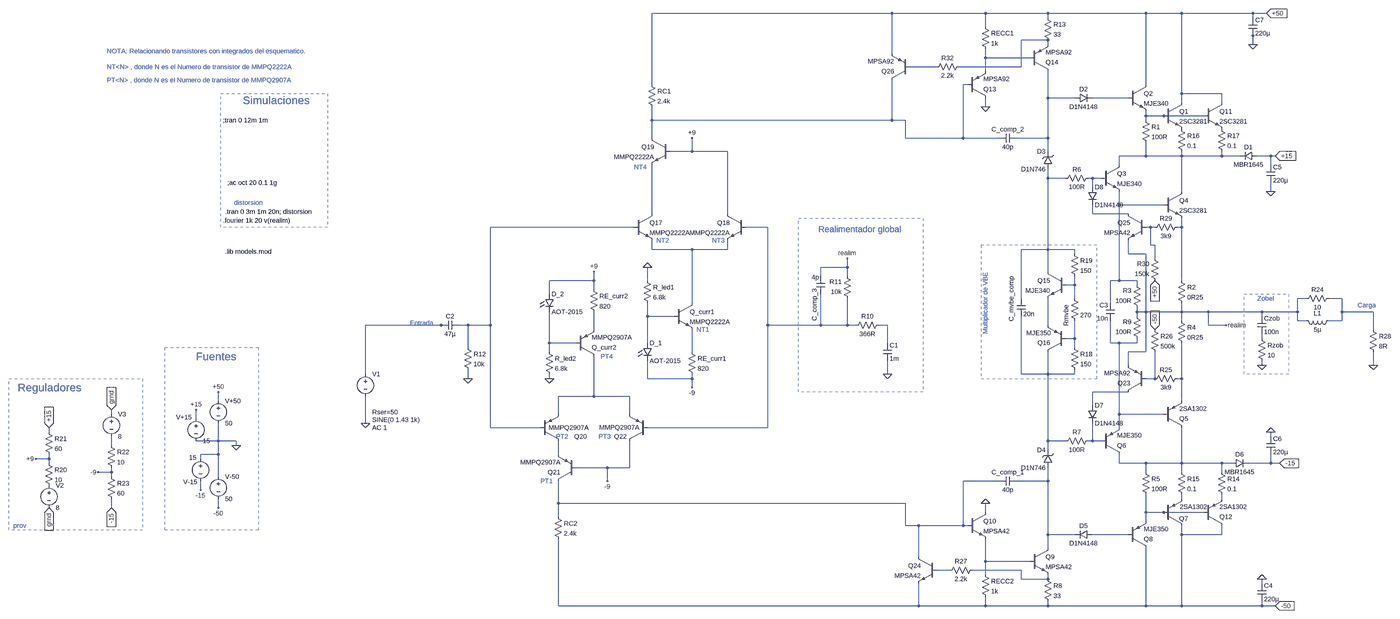
[diagram p0: schematic protecciones10-jun.asc, whole sheet]
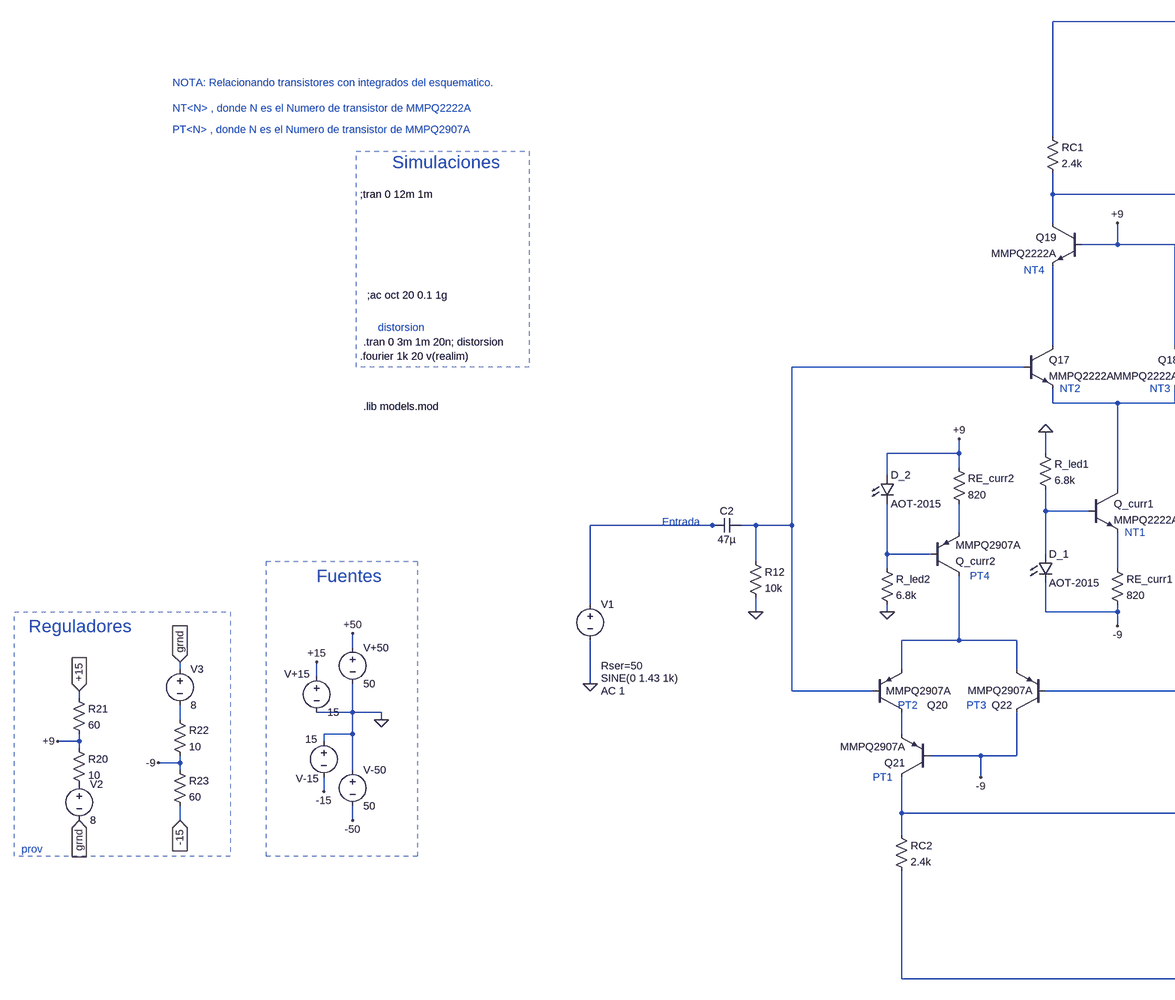
[diagram p1: schematic protecciones10-jun.asc, part, row 1 of 1, column 1 of 2]
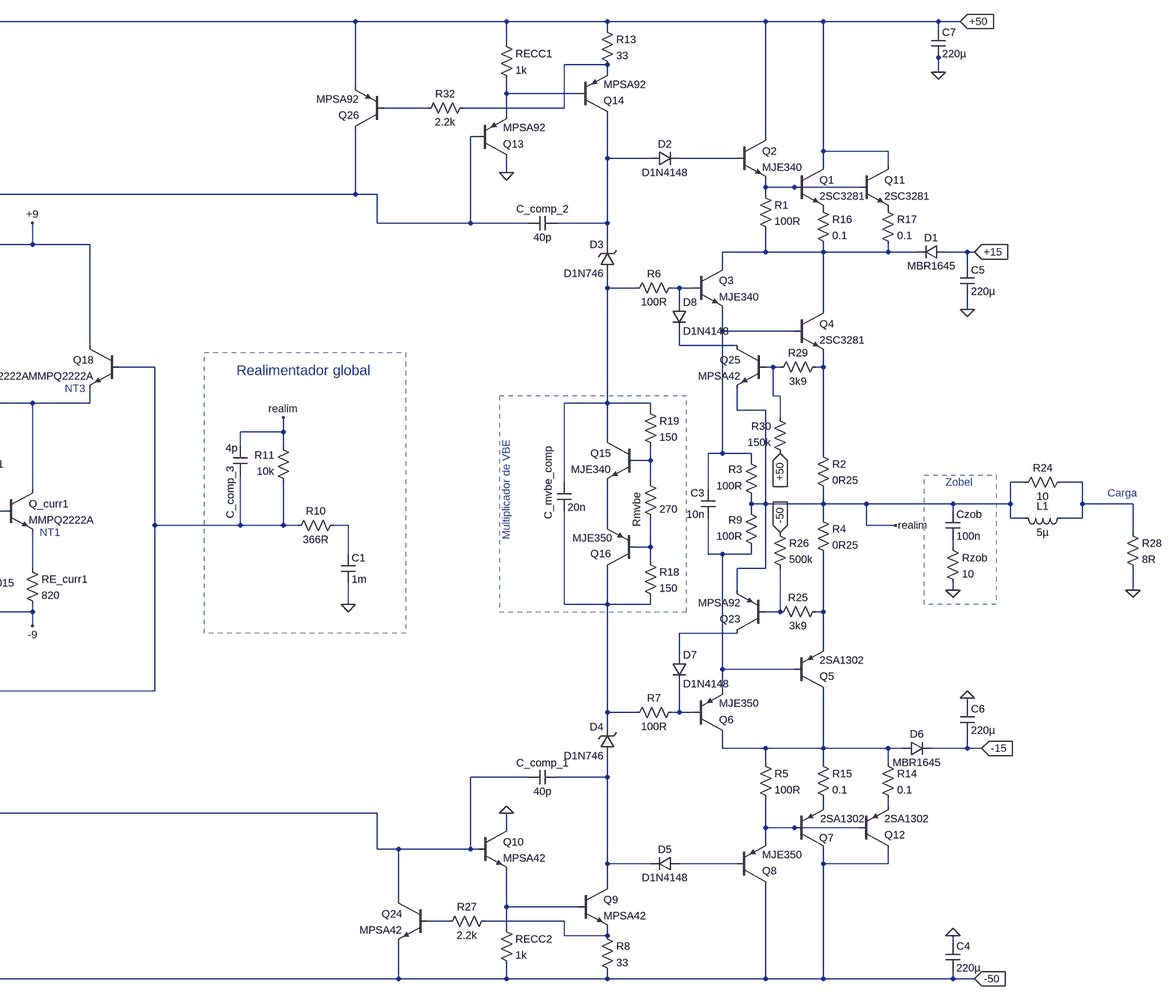
[diagram p2: schematic protecciones10-jun.asc, part, row 1 of 1, column 2 of 2]
protecciones10-jun.asc, the LTspice schematic file:
Version 4
SHEET 1 6132 1256
WIRE 1344 -944 464 -944
WIRE 1680 -944 1344 -944
WIRE 1904 -944 1680 -944
WIRE 2256 -944 1904 -944
WIRE 2384 -944 2256 -944
WIRE 2640 -944 2384 -944
WIRE 2688 -944 2640 -944
WIRE 1904 -928 1904 -944
WIRE 2640 -928 2640 -944
WIRE 1680 -896 1680 -944
WIRE 2640 -864 2640 -880
WIRE 1904 -848 1808 -848
WIRE 1904 -832 1904 -848
WIRE 2640 -832 2640 -864
WIRE 1344 -800 1344 -944
WIRE 1680 -784 1680 -816
WIRE 1840 -784 1680 -784
WIRE 1504 -752 1408 -752
WIRE 1808 -752 1808 -848
WIRE 1808 -752 1584 -752
WIRE 1680 -736 1680 -784
WIRE 464 -688 464 -944
WIRE 1616 -688 1600 -688
WIRE 2256 -688 2256 -944
WIRE 2384 -656 2384 -944
WIRE 2528 -656 2384 -656
WIRE 1904 -640 1904 -736
WIRE 2000 -640 1904 -640
WIRE 2192 -640 2064 -640
WIRE 2384 -624 2384 -656
WIRE 2528 -624 2528 -656
WIRE 1680 -608 1680 -640
WIRE 2256 -576 2256 -592
WIRE 2320 -576 2256 -576
WIRE 2464 -576 2320 -576
WIRE 464 -560 464 -608
WIRE 1344 -560 1344 -704
WIRE 1344 -560 464 -560
WIRE 1392 -560 1344 -560
WIRE 2256 -560 2256 -576
WIRE 464 -496 464 -560
WIRE 1392 -496 1392 -560
WIRE 1600 -496 1600 -688
WIRE 1600 -496 1392 -496
WIRE 1728 -496 1600 -496
WIRE 1904 -496 1904 -640
WIRE 1904 -496 1792 -496
WIRE 608 -448 608 -496
WIRE 608 -448 528 -448
WIRE 736 -448 608 -448
WIRE 1904 -448 1904 -496
WIRE 2256 -432 2256 -480
WIRE 2256 -432 2160 -432
WIRE 2384 -432 2384 -448
WIRE 2384 -432 2256 -432
WIRE 2528 -432 2528 -448
WIRE 2528 -432 2384 -432
WIRE 2592 -432 2528 -432
WIRE 2704 -432 2656 -432
WIRE 2720 -432 2704 -432
WIRE 2160 -400 2160 -432
WIRE 2704 -400 2704 -432
WIRE 1904 -352 1904 -384
WIRE 1968 -352 1904 -352
WIRE 2064 -352 2048 -352
WIRE 2096 -352 2064 -352
WIRE 2064 -320 2064 -352
WIRE 2384 -304 2384 -432
WIRE 2704 -304 2704 -336
WIRE 2160 -256 2160 -304
WIRE 2320 -256 2160 -256
WIRE 464 -224 464 -400
WIRE 736 -224 736 -448
WIRE 2064 -224 2064 -256
WIRE 2192 -224 2064 -224
WIRE 400 -176 -128 -176
WIRE 880 -176 800 -176
WIRE 2272 -176 2256 -176
WIRE 2288 -176 2272 -176
WIRE 2384 -176 2384 -208
WIRE 2384 -176 2368 -176
WIRE 2272 -112 2272 -176
WIRE 2288 -112 2272 -112
WIRE 464 -96 464 -128
WIRE 608 -96 464 -96
WIRE 736 -96 736 -128
WIRE 736 -96 608 -96
WIRE 1904 -96 1904 -352
WIRE 1904 -96 1808 -96
WIRE 2000 -96 1904 -96
WIRE 2000 -80 2000 -96
WIRE 2192 -80 2192 -128
WIRE 2256 -80 2192 -80
WIRE 2288 -64 2288 -112
WIRE 1184 -32 1184 -64
WIRE 1184 -32 1088 -32
WIRE 1904 -16 1904 -96
WIRE 1088 0 1088 -32
WIRE 1184 0 1184 -32
WIRE 256 16 256 -16
WIRE 256 16 96 16
WIRE 448 16 448 -32
WIRE 2160 16 2160 -256
WIRE 2160 16 2128 16
WIRE 2224 16 2160 16
WIRE 2384 16 2384 -176
WIRE 2000 32 2000 0
WIRE 2000 32 1968 32
WIRE 2224 32 2224 16
WIRE 256 48 256 16
WIRE 96 64 96 16
WIRE 1808 80 1808 -96
WIRE 2000 80 2000 32
WIRE 2832 80 2800 80
WIRE 2960 80 2912 80
WIRE 608 96 608 -96
WIRE 2128 96 2128 16
WIRE 2224 128 2224 112
WIRE 2256 128 2256 -80
WIRE 2256 128 2224 128
WIRE 2384 128 2384 96
WIRE 2384 128 2256 128
WIRE 2480 128 2384 128
WIRE 2672 128 2480 128
WIRE 2800 128 2800 80
WIRE 2800 128 2672 128
WIRE 2960 128 2960 80
WIRE 3072 128 2960 128
WIRE 448 144 448 96
WIRE 544 144 448 144
WIRE 2224 144 2224 128
WIRE 2672 144 2672 128
WIRE 2384 160 2384 128
WIRE 2800 160 2800 128
WIRE 2832 160 2800 160
WIRE 2960 160 2960 128
WIRE 2960 160 2912 160
WIRE -304 176 -576 176
WIRE -288 176 -304 176
WIRE -208 176 -240 176
WIRE -128 176 -128 -176
WIRE -128 176 -208 176
WIRE 880 176 880 -176
WIRE 1088 176 1088 64
WIRE 1088 176 880 176
WIRE 1184 176 1184 80
WIRE 1184 176 1088 176
WIRE 1216 176 1184 176
WIRE 1328 176 1296 176
WIRE 1904 176 1904 80
WIRE 2480 176 2480 128
WIRE 2544 176 2480 176
WIRE 256 192 256 128
WIRE 3072 192 3072 128
WIRE 2000 224 2000 160
WIRE 2000 224 1968 224
WIRE 2672 224 2672 208
WIRE 96 240 96 128
WIRE 192 240 96 240
WIRE 448 240 448 144
WIRE 1328 240 1328 176
WIRE 2128 240 2128 160
WIRE 2160 240 2128 240
WIRE 2224 240 2224 224
WIRE 2224 240 2160 240
WIRE -208 256 -208 176
WIRE 2000 256 2000 224
WIRE 96 272 96 240
WIRE 608 272 608 192
WIRE 2256 272 2256 128
WIRE 2256 272 2192 272
WIRE 2192 320 2192 272
WIRE 2672 320 2672 304
WIRE 3072 320 3072 272
WIRE -576 352 -576 176
WIRE 1328 352 1328 304
WIRE 1808 352 1808 144
WIRE 1904 352 1904 272
WIRE 1904 352 1808 352
WIRE 2000 352 2000 336
WIRE 2000 352 1904 352
WIRE -208 368 -208 336
WIRE 96 368 96 352
WIRE 448 368 448 304
WIRE 608 368 608 352
WIRE 608 368 448 368
WIRE 2288 368 2288 272
WIRE 2288 368 2256 368
WIRE 2384 368 2384 240
WIRE 2384 368 2368 368
WIRE 608 400 608 368
WIRE 2192 416 2064 416
WIRE 256 432 256 288
WIRE 256 432 128 432
WIRE 384 432 256 432
WIRE -1184 448 -1184 416
WIRE 2384 448 2384 368
WIRE 2064 464 2064 416
WIRE -1568 496 -1568 480
WIRE 128 496 128 432
WIRE 384 496 384 432
WIRE 2160 496 2160 240
WIRE 2320 496 2160 496
WIRE -1264 512 -1264 480
WIRE -576 528 -576 432
WIRE -128 544 -128 176
WIRE 64 544 -128 544
WIRE 880 544 880 176
WIRE 880 544 448 544
WIRE 2160 544 2160 496
WIRE -1792 560 -1792 544
WIRE 2704 576 2704 560
WIRE -1184 592 -1184 528
WIRE -1184 592 -1264 592
WIRE -1120 592 -1184 592
WIRE 1904 592 1904 352
WIRE 1968 592 1904 592
WIRE 2064 592 2064 528
WIRE 2064 592 2048 592
WIRE 2096 592 2064 592
WIRE -1568 608 -1568 576
WIRE -1120 608 -1120 592
WIRE 1904 624 1904 592
WIRE -1184 640 -1184 592
WIRE -1184 640 -1248 640
WIRE 128 640 128 592
WIRE -1792 656 -1792 640
WIRE -1792 656 -1840 656
WIRE -1248 656 -1248 640
WIRE -1792 672 -1792 656
WIRE 2160 672 2160 640
WIRE 2256 672 2160 672
WIRE 2304 672 2256 672
WIRE 2384 672 2384 544
WIRE 2384 672 2304 672
WIRE 2528 672 2384 672
WIRE 2560 672 2528 672
WIRE 2704 672 2704 640
WIRE 2704 672 2624 672
WIRE 2736 672 2704 672
WIRE 304 688 192 688
WIRE 384 688 384 592
WIRE 384 688 304 688
WIRE -1568 704 -1568 688
WIRE -1568 704 -1616 704
WIRE 2256 704 2256 672
WIRE 2384 704 2384 672
WIRE 2528 704 2528 672
WIRE -1568 720 -1568 704
WIRE -1184 720 -1184 640
WIRE 304 736 304 688
WIRE 1728 736 1600 736
WIRE 1904 736 1904 688
WIRE 1904 736 1792 736
WIRE -1248 768 -1248 736
WIRE 2384 800 2384 784
WIRE 2528 800 2528 784
WIRE 128 816 128 736
WIRE 1392 816 128 816
WIRE -1568 832 -1568 800
WIRE -1184 832 -1184 800
WIRE 1680 848 1680 816
WIRE 2256 848 2256 784
WIRE 2320 848 2256 848
WIRE 2464 848 2320 848
WIRE 128 864 128 816
WIRE 2256 880 2256 848
WIRE 1392 896 1392 816
WIRE 1440 896 1392 896
WIRE 1600 896 1600 736
WIRE 1600 896 1440 896
WIRE 1616 896 1600 896
WIRE 1904 928 1904 736
WIRE 2000 928 1904 928
WIRE 2192 928 2064 928
WIRE 2384 928 2384 896
WIRE 2528 928 2528 896
WIRE 2528 928 2384 928
WIRE 1904 976 1904 928
WIRE 1440 1008 1440 896
WIRE 1680 1024 1680 944
WIRE 1840 1024 1680 1024
WIRE 1552 1056 1504 1056
WIRE 1808 1056 1632 1056
WIRE 1680 1072 1680 1024
WIRE 1808 1088 1808 1056
WIRE 1904 1088 1904 1072
WIRE 1904 1088 1808 1088
WIRE 2672 1104 2672 1088
WIRE 128 1184 128 944
WIRE 1440 1184 1440 1104
WIRE 1440 1184 128 1184
WIRE 1680 1184 1680 1152
WIRE 1680 1184 1440 1184
WIRE 1904 1184 1904 1168
WIRE 1904 1184 1680 1184
WIRE 2256 1184 2256 976
WIRE 2256 1184 1904 1184
WIRE 2384 1184 2384 928
WIRE 2384 1184 2256 1184
WIRE 2672 1184 2672 1168
WIRE 2672 1184 2384 1184
WIRE 2720 1184 2672 1184
FLAG -1120 608 0
FLAG -1184 416 +50
FLAG -1264 480 +15
FLAG -1248 768 -15
FLAG -1184 832 -50
FLAG 2720 1184 -50
IOPIN 2720 1184 In
FLAG 2736 672 -15
IOPIN 2736 672 In
FLAG 2688 -944 +50
IOPIN 2688 -944 In
FLAG 2720 -432 +15
IOPIN 2720 -432 In
FLAG 1184 -64 realim
FLAG 2544 176 realim
FLAG -208 368 0
FLAG 1680 -608 0
FLAG 1680 816 0
FLAG 2640 -832 0
FLAG 2704 -304 0
FLAG 2704 560 0
FLAG 2672 1088 0
FLAG -1792 544 +15
IOPIN -1792 544 In
FLAG -1792 832 grnd
IOPIN -1792 832 In
FLAG -1840 656 +9
FLAG -1568 480 grnd
IOPIN -1568 480 In
FLAG -1616 704 -9
FLAG -1568 832 -15
IOPIN -1568 832 In
FLAG 608 -496 +9
FLAG 608 400 -9
FLAG 256 -16 +9
FLAG 304 736 -9
FLAG 96 368 0
FLAG 448 -32 0
FLAG 1328 352 0
FLAG 2672 320 0
FLAG -576 528 0
FLAG 3072 320 0
FLAG 2288 16 +50
IOPIN 2288 16 In
FLAG 2288 192 -50
IOPIN 2288 192 In
DATAFLAG 2304 672 "round($*100)/100"
DATAFLAG -1792 656 "round($*100)/100"
DATAFLAG -1568 704 "round($*100)/100"
SYMBOL voltage -1248 640 R0
WINDOW 0 -62 99 Left 2
WINDOW 3 -41 12 Left 2
WINDOW 123 0 0 Left 2
WINDOW 39 0 0 Left 2
SYMATTR InstName V-15
SYMATTR Value 15
SYMBOL voltage -1184 432 R0
SYMATTR InstName V+50
SYMATTR Value 50
SYMBOL voltage -1264 496 R0
WINDOW 0 -72 11 Left 2
SYMATTR InstName V+15
SYMATTR Value 15
SYMBOL voltage -1184 704 R0
SYMATTR InstName V-50
SYMATTR Value 50
SYMBOL npn 2320 -624 R0
SYMATTR InstName Q1
SYMATTR Value 2SC3281
SYMBOL npn 2192 -688 R0
SYMATTR InstName Q2
SYMATTR Value MJE340
SYMBOL res 2240 -576 R0
SYMATTR InstName R1
SYMATTR Value 100R
SYMBOL diode 2656 -416 M270
WINDOW 0 32 32 VTop 2
WINDOW 3 0 32 VBottom 2
SYMATTR InstName D1
SYMATTR Value MBR1645
SYMBOL diode 2000 -624 R270
WINDOW 0 32 32 VTop 2
WINDOW 3 0 32 VBottom 2
SYMATTR InstName D2
SYMATTR Value D1N4148
SYMBOL zener 1920 -384 R180
WINDOW 0 24 64 Left 2
WINDOW 3 24 0 Left 2
SYMATTR InstName D3
SYMATTR Value D1N746
SYMBOL npn 2096 -400 R0
SYMATTR InstName Q3
SYMATTR Value MJE340
SYMBOL npn 2320 -304 R0
SYMATTR InstName Q4
SYMATTR Value 2SC3281
SYMBOL res 2368 0 R0
SYMATTR InstName R2
SYMATTR Value 0R25
SYMBOL res 2240 128 R180
WINDOW 0 36 76 Left 2
WINDOW 3 36 40 Left 2
SYMATTR InstName R3
SYMATTR Value 100R
SYMBOL res 2368 144 R0
SYMATTR InstName R4
SYMATTR Value 0R25
SYMBOL pnp 2320 544 M180
SYMATTR InstName Q5
SYMATTR Value 2SA1302
SYMBOL pnp 2096 640 M180
SYMATTR InstName Q6
SYMATTR Value MJE350
SYMBOL pnp 2320 896 M180
WINDOW 0 55 25 Left 2
WINDOW 3 57 68 Left 2
SYMATTR InstName Q7
SYMATTR Value 2SA1302
SYMBOL pnp 2192 976 M180
SYMATTR InstName Q8
SYMATTR Value MJE350
SYMBOL res 2240 688 R0
SYMATTR InstName R5
SYMATTR Value 100R
SYMBOL zener 1920 688 R180
WINDOW 0 24 64 Left 2
WINDOW 3 24 0 Left 2
SYMATTR InstName D4
SYMATTR Value D1N746
SYMBOL diode 2064 912 R90
WINDOW 0 0 32 VBottom 2
WINDOW 3 32 32 VTop 2
SYMATTR InstName D5
SYMATTR Value D1N4148
SYMBOL diode 2560 688 R270
WINDOW 0 32 32 VTop 2
WINDOW 3 0 32 VBottom 2
SYMATTR InstName D6
SYMATTR Value MBR1645
SYMBOL res 2064 -368 R90
WINDOW 0 0 56 VBottom 2
WINDOW 3 32 56 VTop 2
SYMATTR InstName R6
SYMATTR Value 100R
SYMBOL res 2064 576 R90
WINDOW 0 0 56 VBottom 2
WINDOW 3 32 56 VTop 2
SYMATTR InstName R7
SYMATTR Value 100R
SYMBOL npn 1840 976 R0
SYMATTR InstName Q9
SYMATTR Value MPSA42
SYMBOL res 1888 1072 R0
SYMATTR InstName R8
SYMATTR Value 33
SYMBOL npn 1616 848 R0
SYMATTR InstName Q10
SYMATTR Value MPSA42
SYMBOL res 2240 240 R180
WINDOW 0 36 76 Left 2
WINDOW 3 36 40 Left 2
SYMATTR InstName R9
SYMATTR Value 100R
SYMBOL res 1200 192 R270
WINDOW 0 32 56 VTop 2
WINDOW 3 0 56 VBottom 2
SYMATTR InstName R10
SYMATTR Value 366R
SYMBOL res 1200 96 R180
WINDOW 0 36 76 Left 2
WINDOW 3 36 40 Left 2
SYMATTR InstName R11
SYMATTR Value 10k
SYMBOL res -224 240 R0
SYMATTR InstName R12
SYMATTR Value 10k
SYMBOL cap 1312 240 R0
SYMATTR InstName C1
SYMATTR Value 1m
SYMBOL cap -240 160 R90
WINDOW 0 0 32 VBottom 2
WINDOW 3 32 32 VTop 2
SYMATTR InstName C2
SYMATTR Value 47µ
SYMBOL cap 1792 720 R90
WINDOW 0 0 32 VBottom 2
WINDOW 3 32 32 VTop 2
SYMATTR InstName C_comp_1
SYMATTR Value 40p
SYMBOL cap 2144 160 R180
WINDOW 0 24 56 Left 2
WINDOW 3 24 8 Left 2
SYMATTR InstName C3
SYMATTR Value 10n
SYMBOL npn 2464 -624 R0
SYMATTR InstName Q11
SYMATTR Value 2SC3281
SYMBOL pnp 2464 896 M180
SYMATTR InstName Q12
SYMATTR Value 2SA1302
SYMBOL cap 2656 1104 R0
SYMATTR InstName C4
SYMATTR Value 220µ
SYMBOL cap 2688 -400 R0
SYMATTR InstName C5
SYMATTR Value 220µ
SYMBOL cap 2688 576 R0
SYMATTR InstName C6
SYMATTR Value 220µ
SYMBOL cap 2624 -928 R0
SYMATTR InstName C7
SYMATTR Value 220µ
SYMBOL pnp 1616 -640 M180
SYMATTR InstName Q13
SYMATTR Value MPSA92
SYMBOL pnp 1840 -736 M180
SYMATTR InstName Q14
SYMATTR Value MPSA92
SYMBOL cap 1792 -512 R90
WINDOW 0 0 32 VBottom 2
WINDOW 3 32 32 VTop 2
SYMATTR InstName C_comp_2
SYMATTR Value 40p
SYMBOL res 1888 -944 R0
SYMATTR InstName R13
SYMATTR Value 33
SYMBOL res 2512 688 R0
SYMATTR InstName R14
SYMATTR Value 0.1
SYMBOL res 2368 688 R0
SYMATTR InstName R15
SYMATTR Value 0.1
SYMBOL res 2368 -544 R0
SYMATTR InstName R16
SYMATTR Value 0.1
SYMBOL res 2512 -544 R0
SYMATTR InstName R17
SYMATTR Value 0.1
SYMBOL cap 1104 64 R180
WINDOW 0 38 20 VLeft 2
WINDOW 3 21 60 Left 2
SYMATTR InstName C_comp_3
SYMATTR Value 4p
SYMBOL npn 1968 -16 M0
SYMATTR InstName Q15
SYMATTR Value MJE340
SYMBOL pnp 1968 272 R180
WINDOW 0 56 33 Left 2
WINDOW 3 53 68 Left 2
SYMATTR InstName Q16
SYMATTR Value MJE350
SYMBOL res 1984 64 R0
WINDOW 0 -14 116 VLeft 2
SYMATTR InstName Rmvbe
SYMATTR Value 270
SYMBOL res 1984 240 R0
SYMATTR InstName R18
SYMATTR Value 150
SYMBOL cap 1792 80 R0
WINDOW 0 -19 83 VLeft 2
SYMATTR InstName C_mvbe_comp
SYMATTR Value 20n
SYMBOL res 1984 -96 R0
SYMATTR InstName R19
SYMATTR Value 150
SYMBOL voltage -1792 736 R0
WINDOW 123 0 0 Left 2
WINDOW 39 0 0 Left 2
SYMATTR InstName V2
SYMATTR Value 8
SYMBOL res -1808 656 R0
SYMATTR InstName R20
SYMATTR Value 10
SYMBOL res -1808 544 R0
SYMATTR InstName R21
SYMATTR Value 60
SYMBOL voltage -1568 480 R0
WINDOW 123 0 0 Left 2
WINDOW 39 0 0 Left 2
SYMATTR InstName V3
SYMATTR Value 8
SYMBOL res -1584 592 R0
SYMATTR InstName R22
SYMATTR Value 10
SYMBOL res -1584 704 R0
SYMATTR InstName R23
SYMATTR Value 60
SYMBOL npn 544 96 R0
SYMATTR InstName Q_curr1
SYMATTR Value MMPQ2222A
SYMBOL npn 400 -224 R0
SYMATTR InstName Q17
SYMATTR Value MMPQ2222A
SYMBOL npn 800 -224 M0
SYMATTR InstName Q18
SYMATTR Value MMPQ2222A
SYMBOL res 432 0 R0
SYMATTR InstName R_led1
SYMATTR Value 6.8k
SYMBOL res 592 256 R0
SYMATTR InstName RE_curr1
SYMATTR Value 820
SYMBOL LED 432 240 R0
SYMATTR InstName D_1
SYMATTR Value AOT-2015
SYMBOL res 448 -704 R0
SYMATTR InstName RC1
SYMATTR Value 2.4k
SYMBOL npn 528 -496 M0
SYMATTR InstName Q19
SYMATTR Value MMPQ2222A
SYMBOL res 240 32 R0
SYMATTR InstName RE_curr2
SYMATTR Value 820
SYMBOL pnp 192 288 M180
SYMATTR InstName Q_curr2
SYMATTR Value MMPQ2907A
SYMBOL pnp 64 592 M180
WINDOW 0 121 16 Left 2
WINDOW 3 29 48 Left 2
SYMATTR InstName Q20
SYMATTR Value MMPQ2907A
SYMBOL pnp 192 736 R180
SYMATTR InstName Q21
SYMATTR Value MMPQ2907A
SYMBOL res 112 848 R0
SYMATTR InstName RC2
SYMATTR Value 2.4k
SYMBOL pnp 448 592 R180
WINDOW 0 74 16 Left 2
WINDOW 3 28 49 Left 2
SYMATTR InstName Q22
SYMATTR Value MMPQ2907A
SYMBOL LED 80 64 R0
SYMATTR InstName D_2
SYMATTR Value AOT-2015
SYMBOL res 80 256 R0
SYMATTR InstName R_led2
SYMATTR Value 6.8k
SYMBOL res 1664 1056 R0
SYMATTR InstName RECC2
SYMATTR Value 1k
SYMBOL res 1664 -912 R0
SYMATTR InstName RECC1
SYMATTR Value 1k
SYMBOL res 2656 208 R0
SYMATTR InstName Rzob
SYMATTR Value 10
SYMBOL cap 2656 144 R0
SYMATTR InstName Czob
SYMATTR Value 100n
SYMBOL res 2928 64 R90
WINDOW 0 0 56 VBottom 2
WINDOW 3 32 56 VTop 2
SYMATTR InstName R24
SYMATTR Value 10
SYMBOL ind 2928 144 R90
WINDOW 0 5 56 VBottom 2
WINDOW 3 32 56 VTop 2
SYMATTR InstName L1
SYMATTR Value 5µ
SYMBOL voltage -576 336 R0
WINDOW 3 24 180 Left 2
WINDOW 123 24 208 Left 2
WINDOW 39 24 152 Left 2
SYMATTR Value SINE(0 1.43 1k)
SYMATTR Value2 AC 1
SYMATTR SpiceLine Rser=50
SYMATTR InstName V1
SYMBOL res 2384 352 R90
WINDOW 0 0 56 VBottom 2
WINDOW 3 32 56 VTop 2
SYMATTR InstName R25
SYMATTR Value 3k9
SYMBOL pnp 2256 416 R180
SYMATTR InstName Q23
SYMATTR Value MPSA92
SYMBOL diode 2048 464 R0
SYMATTR InstName D7
SYMATTR Value D1N4148
SYMBOL npn 1504 1008 M0
SYMATTR InstName Q24
SYMATTR Value MPSA42
SYMBOL res 1648 1040 R90
WINDOW 0 0 56 VBottom 2
WINDOW 3 32 56 VTop 2
SYMATTR InstName R27
SYMATTR Value 2.2k
SYMBOL res 3056 176 R0
SYMATTR InstName R28
SYMATTR Value 8R
SYMBOL res 2272 176 R0
SYMATTR InstName R26
SYMATTR Value 500k
SYMBOL res 2384 -192 R90
WINDOW 0 0 56 VBottom 2
WINDOW 3 32 56 VTop 2
SYMATTR InstName R29
SYMATTR Value 3k9
SYMBOL res 2304 32 R180
WINDOW 0 36 76 Left 2
WINDOW 3 36 40 Left 2
SYMATTR InstName R30
SYMATTR Value 150k
SYMBOL npn 2256 -224 M0
SYMATTR InstName Q25
SYMATTR Value MPSA42
SYMBOL diode 2048 -320 R0
SYMATTR InstName D8
SYMATTR Value D1N4148
SYMBOL pnp 1408 -704 R180
SYMATTR InstName Q26
SYMATTR Value MPSA92
SYMBOL res 1600 -768 R90
WINDOW 0 0 56 VBottom 2
WINDOW 3 32 56 VTop 2
SYMATTR InstName R32
SYMATTR Value 2.2k
TEXT -1168 -560 Left 2 !;tran 0 12m 1m
TEXT -1168 -200 Left 2 !.fourier 1k 20 v(realim)
TEXT -1264 288 Left 4 ;Fuentes
TEXT -1096 -632 Left 4 ;Simulaciones
TEXT -1160 -232 Left 2 !.tran 0 3m 1m 20n; distorsion
TEXT -1128 -264 Left 2 ;distorsion
TEXT -1152 -336 Left 2 !;ac oct 20 0.1 1g
TEXT -1160 -88 Left 2 !.lib models.mod
TEXT 1680 208 VLeft 2 ;Multiplicador de VBE
TEXT -1904 400 Left 4 ;Reguladores
TEXT -1920 896 Left 2 ;prov
TEXT 1080 -168 Left 3 ;Realimentador global
TEXT 480 -128 Left 2 ;NT2
TEXT 680 -128 Left 2 ;NT3
TEXT 624 192 Left 2 ;NT1
TEXT 400 -392 Left 2 ;NT4
TEXT 120 576 Left 2 ;PT2
TEXT -1584 -752 Left 2 ;NT<N> , donde N es el Numero de transistor de MMPQ2222A
TEXT -1584 -704 Left 2 ;PT<N> , donde N es el Numero de transistor de MMPQ2907A
TEXT -1584 -808 Left 2 ;NOTA: Relacionando transistores con integrados del esquematico.
TEXT 64 736 Left 2 ;PT1
TEXT 272 576 Left 2 ;PT3
TEXT 280 288 Left 2 ;PT4
TEXT 2656 80 Left 2 ;Zobel
TEXT -416 168 Left 2 ;Entrada
TEXT 3016 104 Left 2 ;Carga
RECTANGLE Normal -1040 912 -1376 256 2
RECTANGLE Normal -792 -176 -1176 -656 2
RECTANGLE Normal 1664 368 2080 -112 2
RECTANGLE Normal -1456 912 -1936 368 2
RECTANGLE Normal 1456 416 1008 -208 2
RECTANGLE Normal 2768 352 2608 64 2

The netlist it stands for:
* protecciones10-jun.asc
V-15 0 -15 15
V+50 +50 0 50
V+15 +15 0 15
V-50 0 -50 50
Q1 +50 N007 P001 0 2SC3281
Q2 +50 N006 N007 0 MJE340
R1 N007 N008 100R
D1 +15 N008 MBR1645
D2 N005 N006 D1N4148
D3 N009 N005 D1N746
Q3 N008 N010 N011 0 MJE340
Q4 N008 N011 N017 0 2SC3281
R2 N017 realim 0R25
R3 realim N011 100R
R4 realim N033 0R25
Q5 N039 N029 N033 0 2SA1302
Q6 N039 N036 N029 0 MJE350
Q7 -50 N044 N042 0 2SA1302
Q8 -50 N045 N044 0 MJE350
R5 N039 N044 100R
D4 N041 N031 D1N746
D5 N045 N041 D1N4148
D6 N039 -15 MBR1645
R6 N010 N009 100R
R7 N036 N031 100R
Q9 N041 N046 N048 0 MPSA42
R8 N048 -50 33
Q10 0 N040 N046 0 MPSA42
R9 N029 realim 100R
R10 N015 N023 366R
R11 N015 realim 10k
R12 N014 0 10k
C1 N023 0 1m
C2 N014 N022 47µ
C_comp_1 N041 N040 40p
C3 N029 N011 10n
Q11 +50 N007 P002 0 2SC3281
Q12 -50 N044 N043 0 2SA1302
C4 0 -50 220µ
C5 +15 0 220µ
C6 0 -15 220µ
C7 +50 0 220µ
Q13 0 N004 N002 0 MPSA92
Q14 N005 N002 N001 0 MPSA92
C_comp_2 N005 N004 40p
R13 +50 N001 33
R14 N039 N043 0.1
R15 N039 N042 0.1
R16 P001 N008 0.1
R17 P002 N008 0.1
C_comp_3 N015 realim 4p
Q15 N009 N019 N024 0 MJE340
Q16 N031 N026 N024 0 MJE350
Rmvbe N019 N026 270
R18 N026 N031 150
C_mvbe_comp N009 N031 20n
R19 N009 N019 150
V2 P003 grnd 8
R20 +9 P003 10
R21 +15 +9 60
V3 grnd N037 8
R22 N037 -9 10
R23 -9 -15 60
Q_curr1 N018 N021 N030 0 MMPQ2222A
Q17 N012 N014 N018 0 MMPQ2222A
Q18 +9 N015 N018 0 MMPQ2222A
R_led1 0 N021 6.8k
RE_curr1 N030 -9 820
D_1 N021 -9 AOT-2015
RC1 +50 N004 2.4k
Q19 N004 +9 N012 0 MMPQ2222A
RE_curr2 +9 N025 820
Q_curr2 N035 N028 N025 0 MMPQ2907A
Q20 N038 N014 N035 0 MMPQ2907A
Q21 N040 -9 N038 0 MMPQ2907A
RC2 N040 -50 2.4k
Q22 -9 N015 N035 0 MMPQ2907A
D_2 +9 N028 AOT-2015
R_led2 N028 0 6.8k
RECC2 N046 -50 1k
RECC1 +50 N002 1k
Rzob N027 0 10
Czob realim N027 100n
R24 N020 realim 10
L1 N020 realim 5µ
V1 N022 0 SINE(0 1.43 1k) AC 1 Rser=50
R25 N033 N032 3k9
Q23 N034 N032 realim 0 MPSA92
D7 N034 N036 D1N4148
Q24 N040 N047 -50 0 MPSA42
R27 N048 N047 2.2k
R28 N020 0 8R
R26 -50 N032 500k
R29 N017 N016 3k9
R30 +50 N016 150k
Q25 N013 N016 realim 0 MPSA42
D8 N010 N013 D1N4148
Q26 N004 N003 +50 0 MPSA92
R32 N001 N003 2.2k
.model D D
.lib standard.dio
.model NPN NPN
.model PNP PNP
.lib standard.bjt
;tran 0 12m 1m
.fourier 1k 20 v(realim)
* Fuentes
* Simulaciones
.tran 0 3m 1m 20n; distorsion
* distorsion
;ac oct 20 0.1 1g
.lib models.mod
* Multiplicador de VBE
* Reguladores
* prov
* Realimentador global
* NT2
* NT3
* NT1
* NT4
* PT2
* NT<N> , donde N es el Numero de transistor de MMPQ2222A
* PT<N> , donde N es el Numero de transistor de MMPQ2907A
* NOTA: Relacionando transistores con integrados del esquematico.
* PT1
* PT3
* PT4
* Zobel
* Entrada
* Carga
.backanno
.end